# Altium schematic sheet Maix-II.SchDoc
size A4
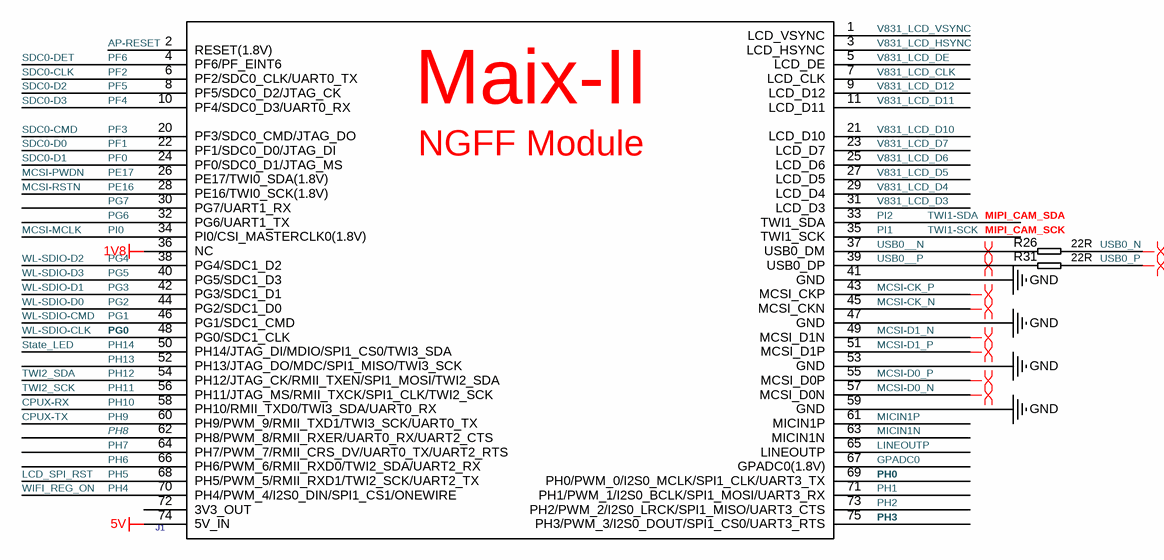
[diagram p0: Maix-II.SchDoc]

## Parts
J1  NGFF-67P_B-KEY座子 4.2H高  [M2-67P0R50_B_FEMALE]  (value not drawn)  (no BOM)
R26  22R  [R0402_M]
R31  22R  [R0402_M]

## Nets
1V8: J1.36(NC)
5V: J1.74(5V_IN)
GND: J1.41(GND) J1.47(GND) J1.53(GND) J1.59(GND)
AP-RESET: J1.2(RESET(1.8V))
CPUX-RX: J1.58(PH10/RMII_TXD0/TWI3_SDA/UART0_RX)  [also labelled PH10]
CPUX-TX: J1.60(PH9/PWM_9/RMII_TXD1/TWI3_SCK/UART0_TX)  [also labelled PH9]
GPADC0: J1.67(GPADC0(1.8V))
LCD_SPI_RST: J1.68(PH5/PWM_5/RMII_RXD1/TWI2_SCK/UART2_TX)  [also labelled PH5]
LINEOUTP: J1.65(LINEOUTP)
MCSI-CK_N: J1.45(MCSI_CKN)
MCSI-CK_P: J1.43(MCSI_CKP)
MCSI-D0_N: J1.57(MCSI_D0N)
MCSI-D0_P: J1.55(MCSI_D0P)
MCSI-D1_N: J1.49(MCSI_D1N)
MCSI-D1_P: J1.51(MCSI_D1P)
MCSI-MCLK: J1.34(PI0/CSI_MASTERCLK0(1.8V))  [also labelled PI0]
MCSI-PWDN: J1.26(PE17/TWI0_SDA(1.8V))  [also labelled PE17]
MCSI-RSTN: J1.28(PE16/TWI0_SCK(1.8V))  [also labelled PE16]
MICIN1N: J1.63(MICIN1N)
MICIN1P: J1.61(MICIN1P)
PF0: J1.24(PF0/SDC0_D1/JTAG_MS)  [also labelled SDC0-D1]
PF1: J1.22(PF1/SDC0_D0/JTAG_DI)  [also labelled SDC0-D0]
PF2: J1.6(PF2/SDC0_CLK/UART0_TX)  [also labelled SDC0-CLK]
PF3: J1.20(PF3/SDC0_CMD/JTAG_DO)  [also labelled SDC0-CMD]
PF4: J1.10(PF4/SDC0_D3/UART0_RX)  [also labelled SDC0-D3]
PF5: J1.8(PF5/SDC0_D2/JTAG_CK)  [also labelled SDC0-D2]
PF6: J1.4(PF6/PF_EINT6)  [also labelled SDC0-DET]
PG0: J1.48(PG0/SDC1_CLK)  [also labelled WL-SDIO-CLK]
PG1: J1.46(PG1/SDC1_CMD)  [also labelled WL-SDIO-CMD]
PG2: J1.44(PG2/SDC1_D0)  [also labelled WL-SDIO-D0]
PG3: J1.42(PG3/SDC1_D1)  [also labelled WL-SDIO-D1]
PG4: J1.38(PG4/SDC1_D2)  [also labelled WL-SDIO-D2]
PG5: J1.40(PG5/SDC1_D3)  [also labelled WL-SDIO-D3]
PG6: J1.32(PG6/UART1_TX)
PG7: J1.30(PG7/UART1_RX)
PH0: J1.69(PH0/PWM_0/I2S0_MCLK/SPI1_CLK/UART3_TX)
PH1: J1.71(PH1/PWM_1/I2S0_BCLK/SPI1_MOSI/UART3_RX)
PH2: J1.73(PH2/PWM_2/I2S0_LRCK/SPI1_MISO/UART3_CTS)
PH3: J1.75(PH3/PWM_3/I2S0_DOUT/SPI1_CS0/UART3_RTS)
PH4: J1.70(PH4/PWM_4/I2S0_DIN/SPI1_CS1/ONEWIRE)  [also labelled WIFI_REG_ON]
PH6: J1.66(PH6/PWM_6/RMII_RXD0/TWI2_SDA/UART2_RX)
PH7: J1.64(PH7/PWM_7/RMII_CRS_DV/UART0_TX/UART2_RTS)
PH8: J1.62(PH8/PWM_8/RMII_RXER/UART0_RX/UART2_CTS)
PH11: J1.56(PH11/JTAG_MS/RMII_TXCK/SPI1_CLK/TWI2_SCK)  [also labelled TWI2_SCK]
PH12: J1.54(PH12/JTAG_CK/RMII_TXEN/SPI1_MOSI/TWI2_SDA)  [also labelled TWI2_SDA]
PH13: J1.52(PH13/JTAG_DO/MDC/SPI1_MISO/TWI3_SCK)
PH14: J1.50(PH14/JTAG_DI/MDIO/SPI1_CS0/TWI3_SDA)  [also labelled State_LED]
PI1: J1.35(TWI1_SCK)  [also labelled TWI1-SCK]
PI2: J1.33(TWI1_SDA)  [also labelled TWI1-SDA]
USB0__N: J1.37(USB0_DM) R26.2
USB0__P: J1.39(USB0_DP) R31.2
USB0_N: R26.1
USB0_P: R31.1
V831_LCD_CLK: J1.7(LCD_CLK)
V831_LCD_D3: J1.31(LCD_D3)
V831_LCD_D4: J1.29(LCD_D4)
V831_LCD_D5: J1.27(LCD_D5)
V831_LCD_D6: J1.25(LCD_D6)
V831_LCD_D7: J1.23(LCD_D7)
V831_LCD_D10: J1.21(LCD_D10)
V831_LCD_D11: J1.11(LCD_D11)
V831_LCD_D12: J1.9(LCD_D12)
V831_LCD_DE: J1.5(LCD_DE)
V831_LCD_HSYNC: J1.3(LCD_HSYNC)
V831_LCD_VSYNC: J1.1(LCD_VSYNC)

Not connected (* = marked no-connect by the designer): J1 72(3V3_OUT)

## Layout directives
differential pair: MCSI-CK_N, MCSI-CK_P, MCSI-D0_N, MCSI-D0_P, MCSI-D1_N, MCSI-D1_P, USB0__N, USB0__P, USB0_N, USB0_P

## Notes on the sheet
- MIPI_CAM_SDA
- (near R26) MIPI_CAM_SCK
- (in symbol NGFF-67P_B-MALE) Maix-II; NGFF Module

## Library data of the parts
J1 = NGFF-67P_B-MALE
R26 R31 = R